# EasyEDA Pro project 000-[SCH+PCB]CheeseCake-BMI270-AUX.epro

# Schematic Cheese
Create Date: 2023-04-10; Page Name: BMI270; Project Name: SlimeVR-CheeseCake; Schematic Name: Cheese; Update Date: 2023-09-29; Company: Designed by SoraKage; Page Size: A4; Version: V2.3
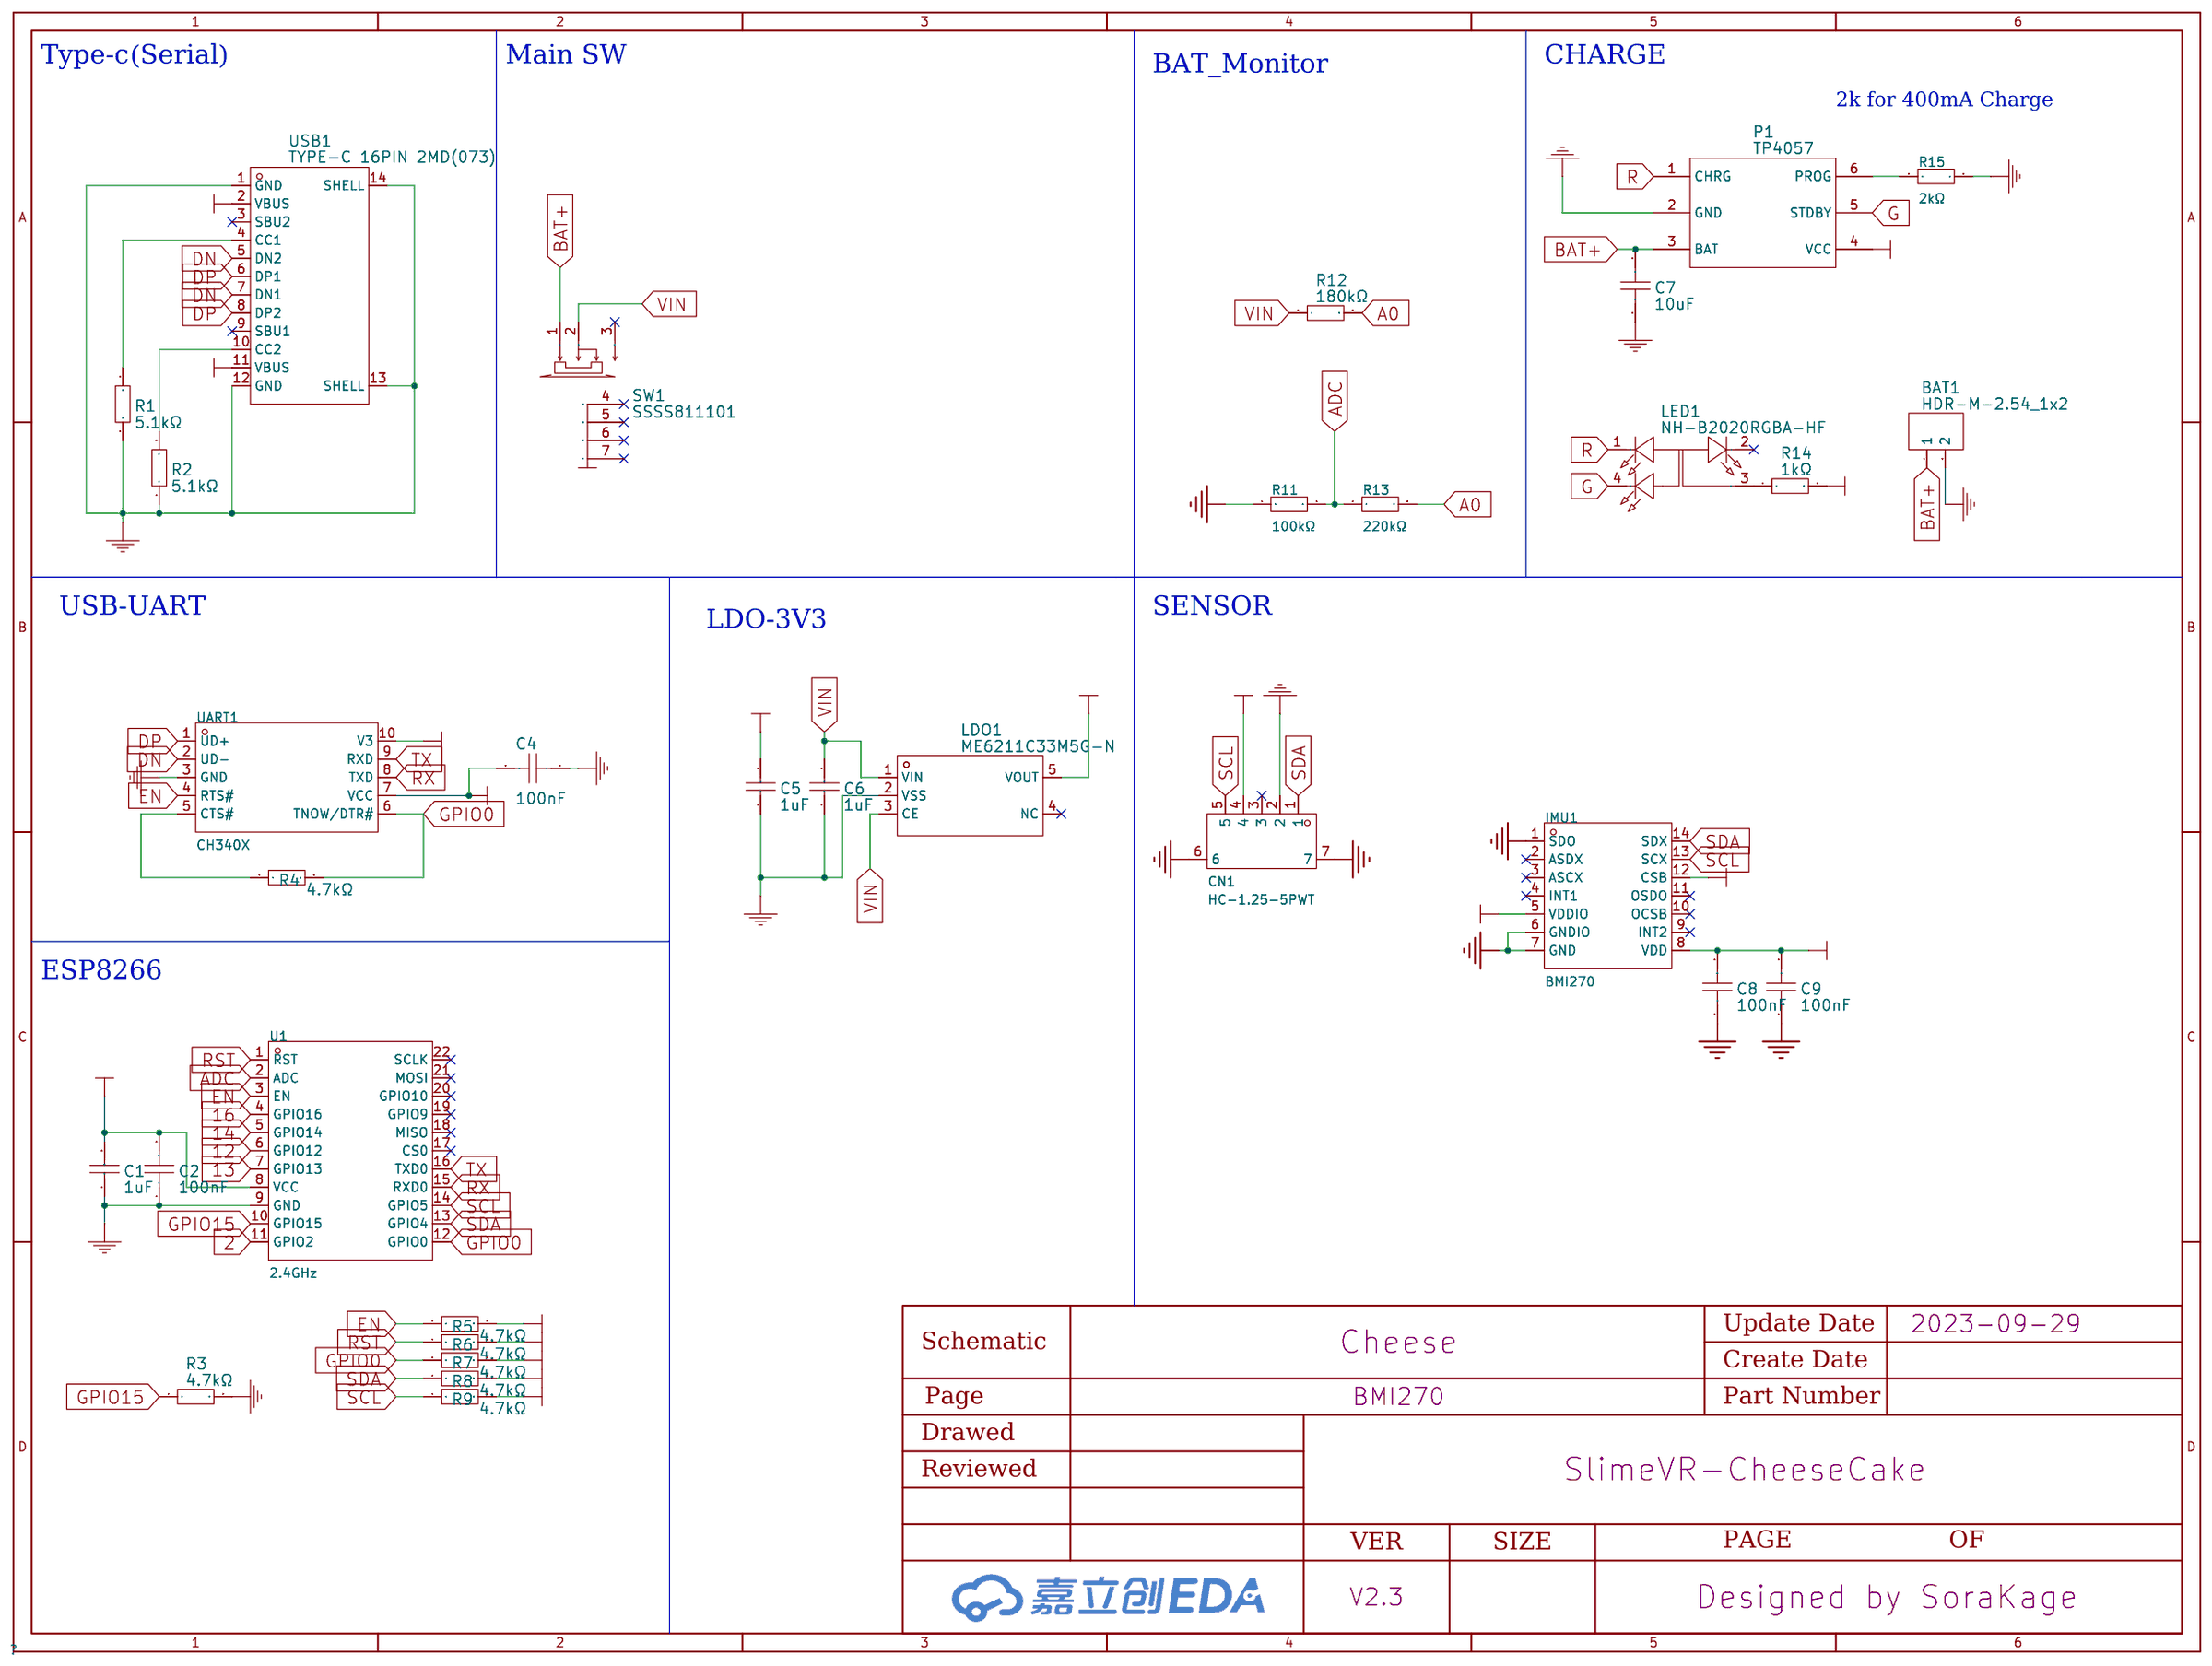
[diagram p0: schematic sheet]

## Parts
BAT1  HDR-M-2.54_1x2  [HDR-M-2.54_1X2]
C1  1uF  [C0603]
C2  100nF  [C0603]
C4  100nF  [C0603]
C5  1uF  [C0603]
C6  1uF  [C0603]
C7  10uF  [C0603]
C8  100nF  [C0603]
C9  100nF  [C0603]
CN1  HC-1.25-5PWT  [CONN-SMD_5P-P1.25_HCTL_HC-1.25-5PWT]
IMU1  BMI270  [LGA-14_L3.0-W2.5-P0.50-BR]
LDO1  ME6211C33M5G-N  [SOT-23-5_L3.0-W1.7-P0.95-LS2.8-BR]
LED1  NH-B2020RGBA-HF  [LED-ARRAY-SMD_4P-L2.1-W2.1-TL_NH-B2020RGBA]
P1  TP4057  [SOT-23-6_L2.9-W1.6-P0.95-LS2.8-BL]
R1  5.1kΩ  [R0603]
R2  5.1kΩ  [R0603]
R3  4.7kΩ  [R0603]
R4  4.7kΩ  [R0603]
R5  4.7kΩ  [R0603]
R6  4.7kΩ  [R0603]
R7  4.7kΩ  [R0603]
R8  4.7kΩ  [R0603]
R9  4.7kΩ  [R0603]
R11  100kΩ  [R0603]
R12  180kΩ  [R0603]
R13  220kΩ  [R0603]
R14  1kΩ  [R0603]
R15  2kΩ  [R0603]
SW1  SSSS811101  [SW-SMD_SSSS811101]
U1  2.4GHz  [WIFIM-SMD_ESP-12F-ESP8266MOD]
UART1  CH340X  [MSOP-10_L3.0-W3.0-P0.50-LS5.0-BL]
USB1  TYPE-C 16PIN 2MD(073)  [USB-C-SMD_TYPE-C-6PIN-2MD-073]

## Library data of the parts
BAT1 = HDR-M-2.54_1x2: Supplier Part: C124375; Supplier: LCSC
C1 C5 C6 = 1uF: link: https://item.szlcsc.com/362304.html; 3DModel: C0603_L1.6-W0.8-H0.8; Supplier: LCSC; Manufacturer Part: CL10A105KB8NNNC; Manufacturer: SAMSUNG(三星); Supplier Part: C15849; JLCPCB Part Class: Basic Part
C2 C4 = 100nF: link: https://item.szlcsc.com/362304.html; 3DModel: C0603_L1.6-W0.8-H0.8; Supplier: LCSC; Manufacturer: YAGEO(国巨); Manufacturer Part: CC0603KRX7R9BB104; Supplier Part: C14663; JLCPCB Part Class: Basic Part
C7 = 10uF: link: https://item.szlcsc.com/362304.html; 3DModel: C0603_L1.6-W0.8-H0.8; Supplier: LCSC; Manufacturer: SAMSUNG(三星); Manufacturer Part: CL10A106KP8NNNC; Supplier Part: C19702; JLCPCB Part Class: Basic Part
C8 C9 = CC0603KRX7R9BB104: Supplier: LCSC; Manufacturer: YAGEO(国巨); Supplier Part: C14663; JLCPCB Part Class: Basic Part
CN1 = HC-1.25-5PWT: 参考系列:-;间距:1.25mm;插针结构:1x5P;排数:1;每排PIN数:5;行距:-;公母:公型插针;安装方式:卧贴;额定电流:1A;工作温度范围:-25℃~+85℃;; LCSC Part Name: 1.25mm 1x5P 卧贴; Supplier Part: C2845382; Manufacturer: HCTL(华灿天禄); Supplier Footprint: SMD,P=1.25mm; JLCPCB Part Class: Extended Part; Datasheet: https://atta.szlcsc.com/upload/public/pdf/source/20210728/C2845379_48B7DC28A4B35DB030A7253F7C3FD974.pdf; Supplier: LCSC; Pitch: 1.25mm; Pins Structure: 1x5P; Number of Rows: 1; Number of PINs Per Row: 5; Gender: 公型插针; Mounting Style: 卧贴; Current Rating (Max): 1A; Operating Temperature Range: -25℃~+85℃
IMU1 = BMI270: IMU-惯性测量单元; Supplier Part: C2836813; Manufacturer: Bosch(博世); Supplier Footprint: LGA-14(2.5x3); JLCPCB Part Class: 扩展库; Datasheet: https://atta.szlcsc.com/upload/public/pdf/source/20210625/C2836813_35E1F3F92097F45A3828DF13DDBA01A5.pdf; Supplier: LCSC
LDO1 = ME6211C33M5G-N: link: https://item.szlcsc.com/236104.html; 3DModel: SOT-23-5_L2.9-W1.6-H1.1-LS2.8-P0.95; Supplier: LCSC; Manufacturer: MICRONE; Supplier Part: C82942; JLCPCB Part Class: Extended Part
LED1 = NH-B2020RGBA-HF: link: https://atta.szlcsc.com/upload/public/pdf/source/20210810/F2CC95523506BC87574AF0308E7F77A3.pdf; Supplier: LCSC; Supplier Part: C2874116; Manufacturer: 国星光电; JLCPCB Part Class: Extended Part
P1 = TP4057-42-SOT26-R: Supplier: LCSC; Manufacturer: TOPPOWER(南京拓微); Supplier Part: C12044; JLCPCB Part Class: Basic Part
R1 R2 = 5.1kΩ: 3DModel: R0603_L1.6-W0.8-H0.8; link: https://www.mouser.in/datasheet/2/447/PYu_RT_1_to_0_01_RoHS_L_11-1669912.pdf; Supplier: LCSC; Manufacturer Part: 0603WAF5101T5E; Manufacturer: UNI-ROYAL(厚声); Supplier Part: C23186; Resistance: 5.1K; JLCPCB Part Class: Basic Part
R3 R5-R7 = 4.7kΩ: 3DModel: R0603_L1.6-W0.8-H0.8; link: https://www.mouser.in/datasheet/2/447/PYu_RT_1_to_0_01_RoHS_L_11-1669912.pdf; Supplier: LCSC; Manufacturer: UNI-ROYAL(厚声); Manufacturer Part: 0603WAF4701T5E; Supplier Part: C23162; Resistance: 4.7K; JLCPCB Part Class: Basic Part
R4 R8 R9 = 0603WAF4701T5E: Supplier: LCSC; Manufacturer: UNI-ROYAL(厚声); Supplier Part: C23162; Resistance: 4.7K; JLCPCB Part Class: Basic Part
R11 = 0603WAF1003T5E: 电阻类型:厚膜电阻;阻值:100kΩ;精度:±1%;功率:100mW;; LCSC Part Name: 100kΩ ±1% 100mW; Supplier Part: C25803; Manufacturer: UNI-ROYAL(厚声); Supplier Footprint: 0603; JLCPCB Part Class: Basic Part; Datasheet: https://atta.szlcsc.com/upload/public/pdf/source/20200306/C422600_1E6D84923E4A46A82E41ADD87F860B5C.pdf; Supplier: LCSC; Type: 厚膜电阻; Tolerance: ±1%; Power(Watts): 100mW; Temperature Coefficient: ±100ppm/℃; Overload Voltage (Max): 75V; Operating Temperature Range: -55℃~+155℃
R12 = 180kΩ: 3DModel: R0603_L1.6-W0.8-H0.8; link: https://www.mouser.in/datasheet/2/447/PYu_RT_1_to_0_01_RoHS_L_11-1669912.pdf; Supplier: LCSC; Manufacturer: UNI-ROYAL(厚声); Manufacturer Part: 0603WAF1803T5E; Supplier Part: C22827; Resistance: 180K; JLCPCB Part Class: Basic Part
R13 = 0603WAF2203T5E: 电阻类型:厚膜电阻;阻值:220kΩ;精度:±1%;功率:100mW;; LCSC Part Name: 220kΩ ±1% 100mW; Supplier Part: C22961; Manufacturer: UNI-ROYAL(厚声); Supplier Footprint: 0603; JLCPCB Part Class: Basic Part; Datasheet: https://atta.szlcsc.com/upload/public/pdf/source/20200306/C422600_1E6D84923E4A46A82E41ADD87F860B5C.pdf; Supplier: LCSC; Type: 厚膜电阻; Tolerance: ±1%; Power(Watts): 100mW; Temperature Coefficient: ±100ppm/℃; Overload Voltage (Max): 75V; Operating Temperature Range: -55℃~+155℃
R14 = 1kΩ: 3DModel: R0603_L1.6-W0.8-H0.8; link: https://www.mouser.in/datasheet/2/447/PYu_RT_1_to_0_01_RoHS_L_11-1669912.pdf; Supplier: LCSC; Manufacturer: UNI-ROYAL(厚声); Manufacturer Part: 0603WAF1001T5E; Supplier Part: C21190; Resistance: 1K; JLCPCB Part Class: Basic Part
R15 = 0603WAF2001T5E: 电阻类型:厚膜电阻;阻值:2kΩ;精度:±1%;功率:100mW;; LCSC Part Name: 2kΩ ±1% 100mW; Supplier Part: C22975; Manufacturer: UNI-ROYAL(厚声); Supplier Footprint: 0603; JLCPCB Part Class: Basic Part; Datasheet: https://atta.szlcsc.com/upload/public/pdf/source/20200306/C422600_1E6D84923E4A46A82E41ADD87F860B5C.pdf; Supplier: LCSC; Type: 厚膜电阻; Tolerance: ±1%; Power(Watts): 100mW; Temperature Coefficient: ±100ppm/℃; Overload Voltage (Max): 75V; Operating Temperature Range: -55℃~+155℃
SW1 = SSSS811101: link: https://item.szlcsc.com/110556.html; 3DModel: SW-TH_SSSS811101; Supplier: LCSC; Manufacturer: ALPSALPINE(阿尔卑斯阿尔派); Supplier Part: C109335; JLCPCB Part Class: Extended Part
U1 = ESP-12F(ESP8266MOD): 频率:2.4GHz;发射功率:16dBm;核心处理器:ESP8266;天线形式:PCB 板载天线;接收灵敏度:-90dBm;; Supplier Part: C82891; Manufacturer: Ai-Thinker(安信可); Supplier Footprint: SMD,16x24mm; JLCPCB Part Class: Extended Part; Datasheet: https://atta.szlcsc.com/upload/public/pdf/source/20210219/C82891_ABD84A460F4F056A2757267CCCA4B508.pdf; Supplier: LCSC; Output Power: 16dBm; Core Processor: ESP8266; Support Interface: GPIO；UART；I2C；PWM；SPI；ADC; Antenna Type: PCB 板载天线; Wireless Standard: 802.11b/g/n; Operating Voltage: 3.3V; Receive  Current: 120mA; Send  Current: 170mA; Sensitivity: -90dBm; Operating Temperature: -40℃~+85℃
UART1 = CH340X: Supplier Part: C3035748; Manufacturer: WCH(南京沁恒); Supplier Footprint: MSOP-10; JLCPCB Part Class: Extended Part; Supplier: LCSC
USB1 = TYPE-C 16PIN 2MD(073): link: https://atta.szlcsc.com/upload/public/pdf/source/20210409/C2765186_34D42616F62DF94D17C4D63D74D9FD03.pdf; Supplier: LCSC; Supplier Part: C2765186; Manufacturer: SHOU HAN(首韩); JLCPCB Part Class: Extended Part

## Nets
3V3: C1.2 C2.2 C4.2 C5.2 C8.2 C9.2 CN1.4 IMU1.5(VDDIO) IMU1.8(VDD) IMU1.12(CSB) LDO1.5(VOUT) R5.2 R6.2 R7.2 R8.2 R9.2 U1.8(VCC) UART1.7(VCC) UART1.10(V3)
+5V: P1.4(VCC) R14.2 USB1.2(VBUS) USB1.11(VBUS)
GND: BAT1.2 C1.1 C2.1 C4.1 C5.1 C6.1 C7.1 C8.1 C9.1 CN1.2 CN1.6 CN1.7 IMU1.1(SDO) IMU1.6(GNDIO) IMU1.7(GND) LDO1.2(VSS) P1.2(GND) R1.1 R2.1 R3.2 R11.1 R15.2 U1.9(GND) UART1.3(GND) USB1.1(GND) USB1.12(GND) USB1.13(SHELL) USB1.14(SHELL)
VIN: C6.2 LDO1.1(VIN) LDO1.3(CE) R12.1 SW1.2
2: U1.11(GPIO2)
12: U1.6(GPIO12)
13: U1.7(GPIO13)
14: U1.5(GPIO14)
16: U1.4(GPIO16)
A0: R12.2 R13.2
ADC: R11.2 R13.1 U1.2(ADC)
BAT+: BAT1.1 C7.2 P1.3(BAT) SW1.1
DN: UART1.2(UD-) USB1.5(DN2) USB1.7(DN1)
DP: UART1.1(UD+) USB1.6(DP1) USB1.8(DP2)
EN: R5.1 U1.3(EN) UART1.4(RTS#)
G: LED1.4(-) P1.5(STDBY)
GPIO0: R4.2 R7.1 U1.12(GPIO0) UART1.6(TNOW/DTR#)
GPIO15: R3.1 U1.10(GPIO15)
R: LED1.1(-) P1.1(CHRG)
RST: R6.1 U1.1(RST)
RX: U1.15(RXD0) UART1.8(TXD)
SCL: CN1.5 IMU1.13(SCX) R9.1 U1.14(GPIO5)
SDA: CN1.1 IMU1.14(SDX) R8.1 U1.13(GPIO4)
TX: U1.16(TXD0) UART1.9(RXD)
$1N6016: R1.2 USB1.4(CC1)
$1N6017: R2.2 USB1.10(CC2)
$1N6024: P1.6(PROG) R15.1
$1N6098: LED1.3(+) R14.1
$1N22824: R4.1 UART1.5(CTS#)

Not connected (* = marked no-connect by the designer): CN1 3*; IMU1 2(ASDX)* 3(ASCX)* 4(INT1)* 9(INT2)* 10(OCSB)* 11(OSDO)*; LDO1 4(NC)*; LED1 2(-)*; SW1 3* 4* 5* 6* 7*; U1 17(CS0)* 18(MISO)* 19(GPIO9)* 20(GPIO10)* 21(MOSI)* 22(SCLK)*; USB1 3(SBU2)* 9(SBU1)*

## Notes on the sheet
- Type-c(Serial)
- Main SW
- BAT_Monitor
- CHARGE
- 2k for 400mA Charge
- USB-UART
- SENSOR
- LDO-3V3
- ESP8266

# Board Cheese_270
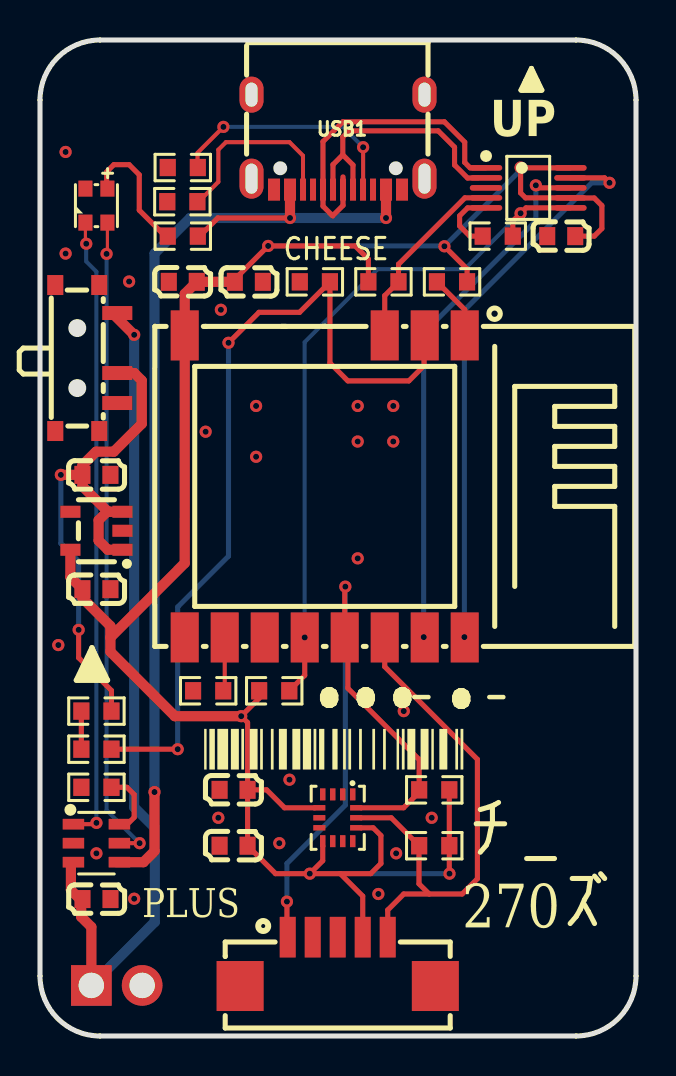
[diagram p1: board, top side]
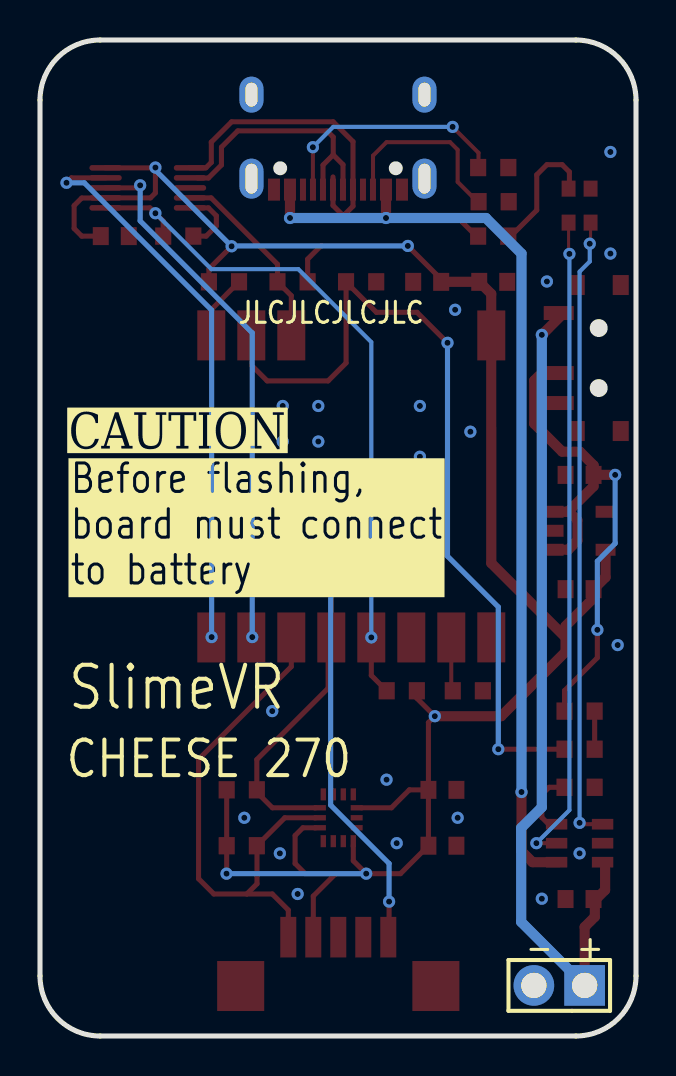
[diagram p2: board, bottom side, seen from below]

Outline 29.8 x 49.8 mm; copper layers: Top Layer, Bottom Layer. Coordinates in mm from the lower left corner of the outline.
Outline path: 0,46.8 0,3 arc(0.88,0.88) 3,0 26.8,0 arc(28.92,0.88) 29.8,3 29.8,46.8 arc(28.92,48.92) 26.8,49.8 3,49.8 arc(0.88,48.92) 0,46.8
Stack: Top Layer 0.035mm / Dielectric1 0.91mm FR4 er 4.5 / Bottom Layer 0.035mm

## Design rules (mm)
spacing Default (default): track to track 0.127, other pairs 0 to 0.127
track width Default (default): min 0.127, default 0.127, max 25.4
differential pair differentialPair (default): width min 0.127, default 0.254, max 2.54; gap min 0.152, default 0.152
via Default (default): diameter min 0.61, default 0.61, max 100.025; hole min 0.305, default 0.305, max 59.995
net GND uses gge20888(1)

## Placement (name value [footprint] x y rotation side)
BAT1  HDR-M-2.54_1x2  [HDR-M-2.54_1X2]  3.84 2.53 0 bottom
C1  1uF  [C0603]  7.14 37.71 0 top
C2  100nF  [C0603]  10.44 37.71 180 top
C4  100nF  [C0603]  26.06 39.99 0 top
C5  1uF  [C0603]  2.82 22.34 180 top
C6  1uF  [C0603]  2.82 28.06 180 top
C7  10uF  [C0603]  2.82 6.85 180 top
C8  100nF  [C0603]  9.68 12.31 0 top
C9  100nF  [C0603]  9.68 9.51 0 top
CN1  HC-1.25-5PWT  [conn-smd_5p-p1.25_hctl_hc-1.25-5pwt]  14.89 3.8 0 top
ESP1  2.4GHz  [wifim-smd_esp-12f-esp8266mod]  13.59 27.48 180 top
IMU1  BMI270  [LGA-14_L3.0-W2.5-P0.50-BR]  14.89 10.91 90 top
LDO1  ME6211C33M5G-N  [SOT-23-5_L3.0-W1.7-P0.95-LS2.8-BR]  2.82 25.26 0 top
LED1  NH-B2020RGBA-HF  [LED-ARRAY-SMD_4P-L2.1-W2.1-TL_NH-B2020RGBA]  2.82 41.52 90 top
P1  TP4057  [SOT-23-6_L2.9-W1.6-P0.95-LS2.8-BL]  2.82 9.64 270 top
R1  5.1kΩ  [R0603]  7.14 43.42 0 top
R2  5.1kΩ  [R0603]  7.12 41.72 0 top
R3  4.7kΩ  [R0603]  8.41 17.26 180 top
R4  4.7kΩ  [R0603]  22.89 39.99 0 top
R5  4.7kΩ  [R0603]  17.17 37.71 180 top
R6  4.7kΩ  [R0603]  20.6 37.71 0 top
R7  4.7kΩ  [R0603]  11.71 17.26 180 top
R8  4.7kΩ  [R0603]  19.71 12.31 0 top
R9  4.7kΩ  [R0603]  19.71 9.51 0 top
R11  100kΩ  [R0603]  13.74 37.71 0 top
R12  180kΩ  [R0603]  2.82 16.25 180 top
R13  220kΩ  [R0603]  2.82 14.34 180 top
R14  1kΩ  [R0603]  7.14 39.99 0 top
R15  2kΩ  [R0603]  2.82 12.44 180 top
SW1  SSSS811101  [SW-SMD_SSSS811101]  2.31 33.9 270 top
UART1  CH340X  [MSOP-10_L3.0-W3.0-P0.50-LS5.0-BL]  24.41 42.41 270 top
USB1  TYPE-C 16PIN 2MD(073)  [USB-C-SMD_TYPE-C-6PIN-2MD-073]  14.9 44.69 180 top

## Footprints (pads in the part's own frame, mm; a bottom-side part is the same pattern mirrored in y, then rotated)
C0603
  rect 0.8x0.9 smd: 1(-0.7,0) 2(0.7,0)
conn-smd_5p-p1.25_hctl_hc-1.25-5pwt
  rect 0.8x2.032 smd: 1(-2.5,1.143) 2(-1.25,1.143) 3(0,1.143) 4(1.25,1.143) 5(2.5,1.143)
  rect 2.35x2.5 smd: 6(4.88,-1.3) 7(-4.88,-1.3)
HDR-M-2.54_1X2
  rect 2.032x2.032 hole 1.27: 1(-1.27,0)
  round 2.032 hole 1.27: 2(1.27,0)
LED-ARRAY-SMD_4P-L2.1-W2.1-TL_NH-B2020RGBA
  rect 0.8x0.7 smd: 1(-0.85,0.55) 2(0.85,0.55) 3(0.85,-0.55) 4(-0.85,-0.55)
LGA-14_L3.0-W2.5-P0.50-BR
  rect 0.6x0.27 smd: 1(1.17,-0.75) 2(1.17,-0.25) 3(1.17,0.25) 4(1.17,0.75) 8(-1.17,0.75) 9(-1.17,0.25) 10(-1.17,-0.25) 11(-1.17,-0.75)
  rect 0.27x0.6 smd: 5(0.5,0.92) 6(0,0.92) 7(-0.5,0.92) 12(-0.5,-0.92) 13(0,-0.92) 14(0.5,-0.92)
MSOP-10_L3.0-W3.0-P0.50-LS5.0-BL
  oval 0.28x1.62 smd: 1(-1,-2.11) 2(-0.5,-2.11) 3(0,-2.11) 4(0.5,-2.11) 5(1,-2.11) 6(1,2.11) 7(0.5,2.11) 8(0,2.11) 9(-0.5,2.11) 10(-1,2.11)
R0603
  rect 0.806x0.864 smd: 1(-0.753,0) 2(0.753,0)
SOT-23-5_L3.0-W1.7-P0.95-LS2.8-BR
  rect 1x0.6 smd: 1(1.3,-0.95) 2(1.3,0) 3(1.3,0.95) 4(-1.3,0.95) 5(-1.3,-0.95)
SOT-23-6_L2.9-W1.6-P0.95-LS2.8-BL
  rect 0.532x1.072 smd: 1(-0.95,-1.149) 2(0,-1.149) 3(0.95,-1.149) 4(0.95,1.149) 5(0,1.149) 6(-0.95,1.149)
SW-SMD_SSSS811101
  rect 0.7x1.5 smd: 1(-2.25,1.55) 2(0.75,1.55) 3(2.25,1.55)
  rect 1x0.8 smd: 4(-3.65,0.65) 5(3.65,0.65) 6(3.65,-1.55) 7(-3.65,-1.55)
USB-C-SMD_TYPE-C-6PIN-2MD-073
  rect 0.6x1.1 smd: 1(-3.2,2.375) 2(-2.4,2.375) 11(2.4,2.375) 12(3.2,2.375)
  rect 0.3x1.1 smd: 3(-1.75,2.375) 4(-1.25,2.375) 5(-0.75,2.375) 6(-0.25,2.375) 7(0.25,2.375) 8(0.75,2.375) 9(1.25,2.375) 10(1.75,2.375)
  oval 1.2x2 hole 0.6x1.5: 13(-4.325,1.825) 14(4.325,1.825)
  oval 1.2x1.8 hole 0.6x1.2: 15(-4.325,-2.375) 16(4.325,-2.375)
wifim-smd_esp-12f-esp8266mod
  rect 1.4x2.5 smd: 1(-7.651,-7.551) 2(-5.651,-7.551) 3(-3.651,-7.551) 8(6.349,-7.551) 9(6.349,7.548) 10(4.349,7.55) 11(2.349,7.551) 12(0.349,7.551) 13(-1.651,7.55) 14(-3.651,7.551) 15(-5.651,7.551) 16(-7.651,7.551)

## Nets
3V3: C1.2 C2.2 C4.2 C5.2 C8.2 C9.2 CN1.4 ESP1.8 IMU1.5 IMU1.8 IMU1.12 LDO1.5 R5.2 R6.2 R7.2 R8.2 R9.2 UART1.7 UART1.10
+5V: P1.4 R14.2 USB1.2 USB1.11
GND: BAT1.2 C1.1 C2.1 C4.1 C5.1 C6.1 C7.1 C8.1 C9.1 CN1.2 CN1.6 CN1.7 ESP1.9 IMU1.1 IMU1.6 IMU1.7 LDO1.2 P1.2 R1.1 R2.1 R3.2 R11.1 R15.2 UART1.3 USB1.1 USB1.12 USB1.13 USB1.14
VIN: C6.2 LDO1.1 LDO1.3 R12.1 SW1.2
A0: R12.2 R13.2
ADC: ESP1.2 R11.2 R13.1
BAT+: BAT1.1 C7.2 P1.3 SW1.1
DN: UART1.2 USB1.5 USB1.7
DP: UART1.1 USB1.6 USB1.8
EN: ESP1.3 R5.1 UART1.4
G: LED1.4 P1.5
GPIO0: ESP1.12 R4.2 R7.1 UART1.6
GPIO15: ESP1.10 R3.1
LED: ESP1.11
R: LED1.1 P1.1
RST: ESP1.1 R6.1
RX: ESP1.15 UART1.8
SCL: CN1.5 ESP1.14 IMU1.13 R9.1
SDA: CN1.1 ESP1.13 IMU1.14 R8.1
TX: ESP1.16 UART1.9
$1N6016: R1.2 USB1.4
$1N6017: R2.2 USB1.10
$1N6024: P1.6 R15.1
$1N6098: LED1.3 R14.1
$1N22824: R4.1 UART1.5

Pads without a net: CN1 3; IMU1 2 3 4 9 10 11; LDO1 4; LED1 2; SW1 3 4 5 6 7; USB1 3 9 15 16

## Via types
v1: diameter 0.61, hole 0.305, Top Layer to Bottom Layer, 50 vias

## Routing (per net, layer and track width the routed paths; a pad name or vN(x,y) marks a point on that pad's centre or on a via; arc(x,y) is an arc through that point)
3V3: length 109.9
  Top Layer w0.254: v1(20.47,8.12) 20.47,8.13 R9.2 R8.2 ; 16.03,10.41 16.66,10.41 17.05,10.02 17.05,8.62 16.54,8.12 15.01,8.12 ; C4.2 27.71,39.99 28.09,40.38 28.09,41.52 27.71,41.9 26.53,41.9 UART1.7 ; 10.38,12.31 10.38,9.51 11.78,8.12 v1(13.49,8.12) ; 10.38,12.31 10.38,15.67 v1(10.06,15.99) 10.96,16.89 R7.2 ; 10.38,12.31 11.33,12.31 12.23,11.41 13.74,11.41 ; v1(13.49,8.12) 15.01,8.12 ; v1(13.49,8.12) 14.14,8.76 14.14,9.52 ; 15.01,8.12 16.14,6.99 CN1.4 ; 26.51,41.9 UART1.7 ; UART1.7 24.28,41.91 24.03,42.15 v1(24.03,43.42) 24.05,43.41 UART1.10 ; 9.61,37.71 v1(11.41,39.5) 15.76,39.5 16.42,38.84 R5.2 ; v1(20.22,39.49) 21.35,38.35 R6.2
  Top Layer w0.508: v1(10.06,15.99) 6.74,15.99 3.52,19.21 3.52,19.93 ; 3.52,19.93 3.52,20.5 2.12,21.9 C5.2 1.52,22.94 LDO1.5 ; 3.52,19.93 7.24,23.64 7.24,35.03 7.24,37.11 C1.2 9.61,37.71
  Bottom Layer w0.254: v1(13.49,8.12) v1(20.47,8.12) ; v1(11.41,39.5) 20.24,39.5 24.03,43.3 v1(24.03,43.42)
+5V: length 52.2
  Top Layer w0.254: 7.88,39.88 8.89,40.9 v1(12.5,40.9)
  Top Layer w0.508: 3.84,8.69 5.17,8.69 5.72,9.24 v1(5.72,12.2) ; USB1.2 v1(17.3,40.9) ; USB1.11 v1(12.5,40.9)
  Bottom Layer w0.508: v1(17.3,40.9) v1(12.5,40.9) 7.5,40.9 5.72,39.12 v1(5.72,12.2)
GND:
  vias: v1(0.92,19.55) v1(1.28,44.2) v1(1.28,39.12) v1(2.82,9.13) v1(4.46,37.73) v1(4.71,6.86) v1(8.28,30.22) v1(8.92,10.91) v1(9.04,36.31) v1(10.81,31.5) v1(10.81,28.96) v1(11.97,9.64) v1(12.47,12.82) v1(15.89,31.5) v1(15.89,29.72) v1(15.89,23.88) v1(16.92,7.1) v1(17.66,31.5) v1(17.66,29.72) v1(17.81,9.13) v1(18.19,16.25) v1(19.59,10.91)
VIN: length 28.3
  Top Layer w0.254: v1(1.93,20.31) 1.93,18.91 3.57,17.27 R12.1
  Top Layer w0.508: LDO1.1 3.39,24.31 2.93,24.77 2.93,25.79 3.36,26.21 3.39,26.21 ; 3.39,26.21 3.48,26.21 ; 3.39,26.21 2.12,27.49 C6.2 ; 3.39,26.21 3.48,26.21 ; 3.61,33.15 4.71,33.15 5.09,32.77 5.09,30.61 3.69,29.22 2.8,29.22 2.12,28.54 C6.2 ; 3.48,26.21 LDO1.3 ; C6.2 v1(1.04,28.06)
  Bottom Layer w0.254: v1(1.93,20.31) 1.93,23.74 1.04,24.63 v1(1.04,28.06)
A0: length 1.9
  Top Layer w0.254: R12.2 R13.2
ADC: length 42
  Top Layer w0.254: v1(9.43,34.66) 10.95,36.18 12.98,36.18 14.5,37.7 ; ESP1.2 19.2,35 19.2,33.52 18.44,32.76 15.39,32.76 14.5,33.65 14.5,37.7 ; 14.5,37.7 R11.2 ; R13.1 v1(6.89,14.34)
  Bottom Layer w0.254: v1(6.89,14.34) 6.89,21.45 9.43,23.99 v1(9.43,34.66)
BAT+: length 42.4
  Top Layer w0.508: v1(4.71,35.06) 4.7,35.06 3.61,36.15 ; BAT1.1 2.57,5.45 2.06,5.96 2.06,6.78 1.55,7.3 1.55,8.69
  Bottom Layer w0.508: v1(4.71,35.06) 4.71,11.44 5.74,10.4 5.74,5.7 BAT1.1
DN: length 12.9
  Top Layer w0.254: 15.14,44.06 15.65,43.55 15.65,42.46 15.64,42.45 ; 15.14,44.06 15.14,44.95 15.45,45.26 19.91,45.26 20.73,44.44 20.73,43.55 21.38,42.9 21.91,42.9 ; 15.14,44.06 14.65,43.57 14.65,42.46 14.64,42.45
DP: length 16.2
  Top Layer w0.254: UART1.1 21.51,43.41 21.24,43.68 21.24,44.69 20.22,45.71 15.14,45.71 14.15,44.72 14.15,42.32 14.15,41.49 14.63,41.01 15.15,41.53 15.15,42.95
EN: length 9.6
  Top Layer w0.254: UART1.4 21.24,41.91 17.93,38.59 R5.1 17.24,37.02 ESP1.3
G: length 33
  Top Layer w0.152: v1(3.33,39.11) 3.37,39.15 3.37,40.8
  Top Layer w0.203: v1(4.98,9.64) 3.84,9.64
  Bottom Layer w0.203: v1(3.33,39.11) 3.33,11.29 v1(4.98,9.64)
GPIO0: length 35.1
  Top Layer w0.254: R4.2 23.64,40.75 v1(24.03,41.14) 24.3,41.41 UART1.6 ; ESP1.12 13.24,18.03 R7.1
  Bottom Layer w0.203: 24.03,41.14 21.23,38.34 16.88,38.34 13.23,34.69 v1(13.23,19.93)
GPIO15: length 2.7
  Top Layer w0.203: 9.24,19.94 9.24,17.34 9.16,17.26
R: length 31.7
  Top Layer w0.152: v1(2.31,39.61) 2.27,39.66 2.27,40.8
  Top Layer w0.203: v1(2.82,10.66) 2.75,10.59 1.55,10.59
  Bottom Layer w0.203: 2.82,10.66 2.82,38.22 2.31,38.73 2.31,39.61
RST: length 3.3
  Top Layer w0.254: ESP1.1 21.24,36.32 R6.1
RX: length 26.7
  Top Layer w0.254: v1(24.79,42.53) 24.92,42.41 UART1.8
  Bottom Layer w0.254: v1(19.19,19.95) 19.19,35.15 24.79,40.76 v1(24.79,42.53)
SCL: length 26.6
  Top Layer w0.254: ESP1.14 17.24,18.47 21.87,13.83 21.87,7.86 21.11,7.1 19.46,7.1 ; 16.03,10.91 17.56,10.91 R9.1 18.95,9.51 18.95,7.61 19.46,7.1 ; CN1.5 17.39,6.3 18.19,7.1 19.46,7.1
SDA: length 33.8
  Top Layer w0.254: v1(12.35,6.72) 12.35,4.98 CN1.1 ; 16.03,11.41 18.18,11.41 18.96,12.19 R8.1 18.96,13.82 15.39,17.39 15.39,19.77 ESP1.13 15.24,22.44 v1(15.27,22.47)
  Bottom Layer w0.254: v1(15.27,22.47) 15.27,11.55 12.35,8.62 v1(12.35,6.72)
TX: length 28.3
  Top Layer w0.254: v1(28.47,42.66) 28.23,42.91 UART1.9
  Bottom Layer w0.254: v1(28.47,42.66) 27.59,42.66 21.22,36.29 v1(21.22,19.95)
$1N6016: length 12
  Top Layer w0.203: 7.88,43.57 7.88,44.16 v1(9.17,45.46) ; v1(16.16,44.44) 16.16,42.32 USB1.4
  Bottom Layer w0.203: v1(16.16,44.44) 15.14,45.46 v1(9.17,45.46)
$1N6017: length 9.4
  Top Layer w0.203: 7.88,41.66 8.92,42.7 8.92,44.31 9.3,44.69 12.47,44.69 13.15,44.02 13.15,42.32
$1N6024: length 3.6
  Top Layer w0.254: 3.84,10.59 4.37,10.59 4.71,10.93 4.71,12.07 4.34,12.44 3.45,12.44
$1N6098: length 6.5
  Top Layer w0.254: 6.37,39.88 4.96,41.29 4.96,43.06 4.46,43.57 3.69,43.57 3.33,43.21 3.33,42.48
$1N22824: length 3.4
  Top Layer w0.254: R4.1 21.49,39.99 20.98,40.5 20.98,41.01 21.38,41.41 UART1.5

## Copper pours and planes (outline as drawn; the poured copper is in the pictures)
GND on Top Layer: -2,54.98 30.89,54.98 30.89,-1.53 -2,-1.53
GND on Bottom Layer: -5.31,52.69 31.52,52.69 31.52,-2.3 -5.31,-2.3

## Text on the board
Bottom Silkscreen Layer: JLCJLCJLCJLC | + | - | Before flashing, / board must connect / to battery | CHEESE 270 | SlimeVR | CAUTION
Document Layer: Y | TP4057:3K | Any kind of modify are welcomed! / But please credit me on the / modified board with this logo | ↓↓↓↓
Top Solder Mask Layer: 7A7A | 5F71
Top Silkscreen Layer: CHEESE | PLUS | ー | チ | ズ | UP | ▲ | ● ● ● | ー    ー | ● | 270
